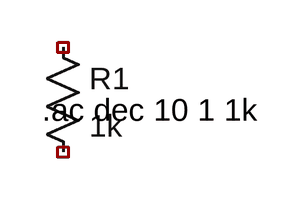
[diagram p0: schematic valid_02.asc]
valid_02.asc, the LTspice schematic file:
Version 4.1
SHEET 1 880 680
SYMBOL res 0 0 R0
WINDOW 0 36 40 Left 2
SYMATTR InstName R1
SYMATTR Value 1k
TEXT 0 64 Left 2 !.ac dec 10 1 1k

The netlist it stands for:
* valid_02.asc
R1 NC_01 NC_02 1k
.ac dec 10 1 1k
.backanno
.end